# Altium schematic sheet MODULOS.schdoc
size 246 x 151 mm
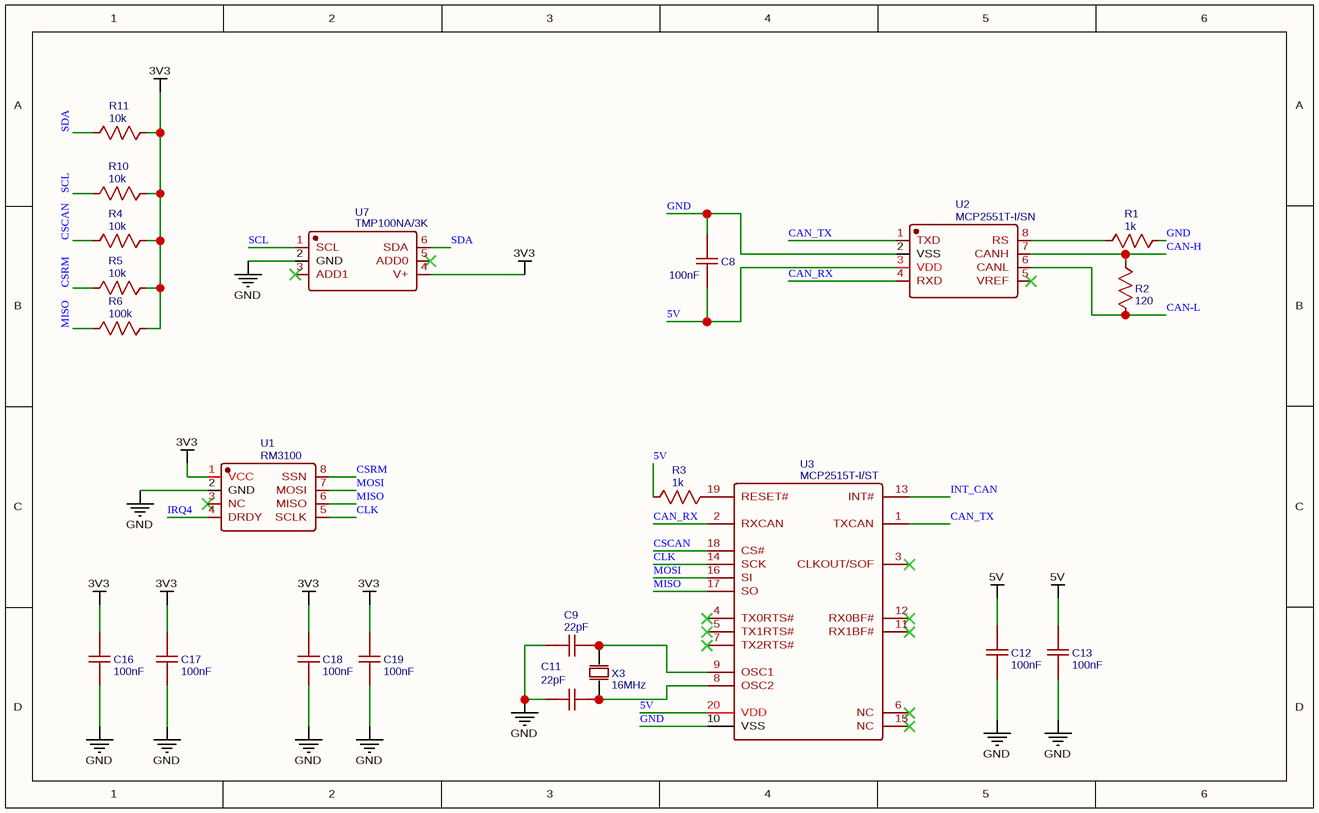
[diagram p0: MODULOS.schdoc]

## Parts
C8  100nF  [C0805]
C9  22pF  [C0805]
C11  22pF  [C0805]
C12  100nF  [C0805]
C13  100nF  [C0805]
C16  100nF  [C0805]
C17  100nF  [C0805]
C18  100nF  [C0805]
C19  100nF  [C0805]
R1  1k  [R0805]
R2  120  [R0805]
R3  1k  [R0805]
R4  10k  [R0805]
R5  10k  [R0805]
R6  100k  [R0805]
R10  10k  [R0805]
R11  10k  [R0805]
U1  RM3100  [RM3100 WIT MOTION]
U2  MCP2551T-I/SN  [SOIC-8_L5.0-W4.0-P1.27-LS6.0-BL]
U3  MCP2515T-I/ST  [TSSOP-20_L6.5-W4.4-P0.65-LS6.4-BL]
U7  TMP100NA/3K  [SOT-23-6_L2.9-W1.6-P0.95-LS2.8-BR]
X3  16MHz  [OSC-TH_L10.0-W4.5-P5.00]

## Nets
3V3: C16.2 C17.2 C18.2 C19.2 R4.1 R5.1 R6.1 R10.1 R11.1 U1.1(VCC) U7.4(V+)
5V: C8.2 C12.2 C13.2 R3.1 U2.3(VDD) U3.20(VDD)
GND: C8.1 C9.1 C11.2 C12.1 C13.1 C16.1 C17.1 C18.1 C19.1 R1.2 U1.2(GND) U2.2(VSS) U3.10(VSS) U7.2(GND)
CAN-H: R2.2 U2.7(CANH)
CAN-L: R2.1 U2.6(CANL)
CAN_RX: U2.4(RXD) U3.2(RXCAN)
CAN_TX: U2.1(TXD) U3.1(TXCAN)
CLK: U1.5(SCLK) U3.14(SCK)
CSCAN: R4.2 U3.18(CS#)
CSRM: R5.2 U1.8(SSN)
INT_CAN: U3.13(INT#)
IRQ4: U1.4(DRDY)
MISO: R6.2 U1.6(MISO) U3.17(SO)
MOSI: U1.7(MOSI) U3.16(SI)
SCL: R10.2 U7.1(SCL)
SDA: R11.2 U7.6(SDA)
NetC9_2: C9.2 U3.9(OSC1) X3.1(OSC1)
NetC11_1: C11.1 U3.8(OSC2) X3.2(OSC2)
NetR1_1: R1.1 U2.8(RS)
NetR3_2: R3.2 U3.19(RESET#)

Not connected (* = marked no-connect by the designer): U1 3(NC)*; U2 5(VREF)*; U3 3(CLKOUT/SOF)* 4(TX0RTS#)* 5(TX1RTS#)* 6(NC)* 7(TX2RTS#)* 11(RX1BF#)* 12(RX0BF#)* 15(NC)*; U7 3(ADD1)* 5(ADD0)*

## Library data of the parts
C8 C12 C13 C16-C19 = 100nF: BOM_Manufacturer Part: CC0805KRX7R9BB104; BOM_Manufacturer: YAGEO(国巨); nameAlias: Value(F); Contributor: LCEDA_Lib; BOM_Supplier Part: C49678; BOM_Supplier: LCSC; spicePre: C; spiceSymbolName: C_0805_US
C9 C11 = 22pF: BOM_Manufacturer Part: CC0805JRNPO9BN220; BOM_Manufacturer: YAGEO(国巨); nameAlias: Value(F); Contributor: LCEDA_Lib; BOM_Supplier Part: C105623; BOM_Supplier: LCSC; spicePre: C; spiceSymbolName: C_0805_US
R1 R3 = 1k: BOM_Manufacturer Part: 0805W8F1001T5E; BOM_Manufacturer: UNI-ROYAL(厚声); nameAlias: Value(Ω); Contributor: LCEDA_Lib; BOM_Supplier Part: C17513; BOM_Supplier: LCSC; spicePre: R; spiceSymbolName: R_0805_US
R2 = 120: BOM_Manufacturer Part: RMC 0805 120R J N; BOM_Manufacturer: Tyohm(幸亚电阻); nameAlias: Value(Ω); Contributor: LCEDA_Lib; BOM_Supplier Part: C269726; BOM_Supplier: LCSC; spicePre: R; spiceSymbolName: R_0805_US
R4 R5 R10 R11 = 10k: BOM_Manufacturer Part: ERJ6ENF1002V; BOM_Manufacturer: PANASONIC(松下); nameAlias: Value(Ω); Contributor: LCEDA_Lib; BOM_Supplier Part: C169253; BOM_Supplier: LCSC; spicePre: R; spiceSymbolName: R_0805_US
R6 = 100k: BOM_Manufacturer Part: CR0805F340RP05; BOM_Manufacturer: EVER OHMS(天二科技); nameAlias: Value(Ω); Contributor: LCEDA_Lib; BOM_Supplier Part: C429267; BOM_Supplier: LCSC; spicePre: R; spiceSymbolName: R_0805_US
U1 = RM3100: BOM_Manufacturer: Wit Motion; Contributor: nitnerolf1; BOM_Supplier: amazon; BOM_Supplier Part: RM3100; link: https://www.wit-motion.com/geomagnetic-sensor/witmotion-high-precision-rm3100-military.html; spicePre: U; spiceSymbolName: RM3100
U2 = MCP2551T-I/SN: BOM_Manufacturer: MICROCHIP(美国微芯); BOM_Supplier: LCSC; BOM_Manufacturer Part: MCP2551T-I/SN; BOM_Supplier Part: C49558; BOM_JLCPCB Part Class: Extended Part; spicePre: U; spiceSymbolName: MCP2551T-I/SN
U3 = MCP2515T-I/ST: BOM_Manufacturer: MICROCHIP(美国微芯); Contributor: LCSC; BOM_Supplier: LCSC; BOM_Supplier Part: C185941; BOM_Manufacturer Part: MCP2515T-I/ST; BOM_JLCPCB Part Class: Extended Part; spicePre: U; spiceSymbolName: MCP2515T-I/ST
U7 = TMP100NA/3K: BOM_Manufacturer: TI(德州仪器); BOM_Supplier: LCSC; BOM_Manufacturer Part: TMP100NA/3K; BOM_Supplier Part: C31810; BOM_JLCPCB Part Class: Extended Part; spicePre: U; spiceSymbolName: TMP100NA/3K
X3 = 16MHz: BOM_Manufacturer: YXC(扬兴晶振); BOM_Manufacturer Part: X49SD16MSD2SC; nameAlias: Frequency; BOM_Supplier: LCSC; BOM_Supplier Part: C16212; BOM_JLCPCB Part Class: Extended Part; spicePre: X; spiceSymbolName: X49SD16MSD2SC